# Altium schematic sheet LeadESDProtection.SchDoc
size B
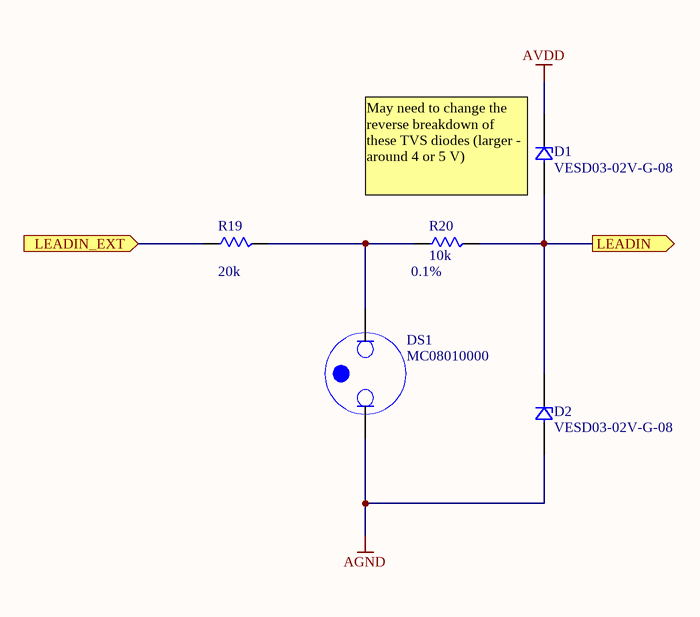
[diagram p0: LeadESDProtection.SchDoc]

## Parts
D1  VESD03-02V-G-08  [SOD-523]
D2  VESD03-02V-G-08  [SOD-523]
DS1  MC08010000  [MC08010000]
R19  value 20k  [RES_MELF_0207]  (hidden comment: RES_GEN)
R20  value 10k  Precision: 0.1%  [RES_0805_PW]  (hidden comment: RES_GEN)

## Ports
LEADIN (out), LEADIN_EXT (in)

## Nets
AGND: D2.1 DS1.1
AVDD: D1.2
LEADIN: D1.1 D2.2 R20.2 ; port LEADIN
LEADIN_EXT: R19.1 ; port LEADIN_EXT
NetDS1_2: DS1.2 R19.2 R20.1

## Notes on the sheet
- (near D1) May need to change the reverse breakdown of these TVS diodes (larger - around 4 or 5 V)

## Library data of the parts
D1 D2 = VESD03-02V-G-08: TVS DIODE 3V 108W SOD523; Manufacturer: Vishay Semiconductors; Manufacturer Part Number: VESD03-02V-G-08
DS1 = MC08010000: LAMP, NEON, T-1 1/4, WIRE; Manufacturer: Multicomp; Manufacturer Part Number: MC08010000
R19 = RES_GEN: RES 20K OHM 1W 2% 0207 MELF; Manufacturer: Vishay Beyschlag; Manufacturer Part Number: CMB02070X2002GB200; Package: MELF 0207
R20 = RES_GEN: RES 10K OHM 1/4W 0.1% 0805; Manufacturer: TT Electronics; Manufacturer Part Number: PFC-W0805LF-03-1002-B-1739